# Altium schematic sheet MainSchematic.SchDoc
size A1
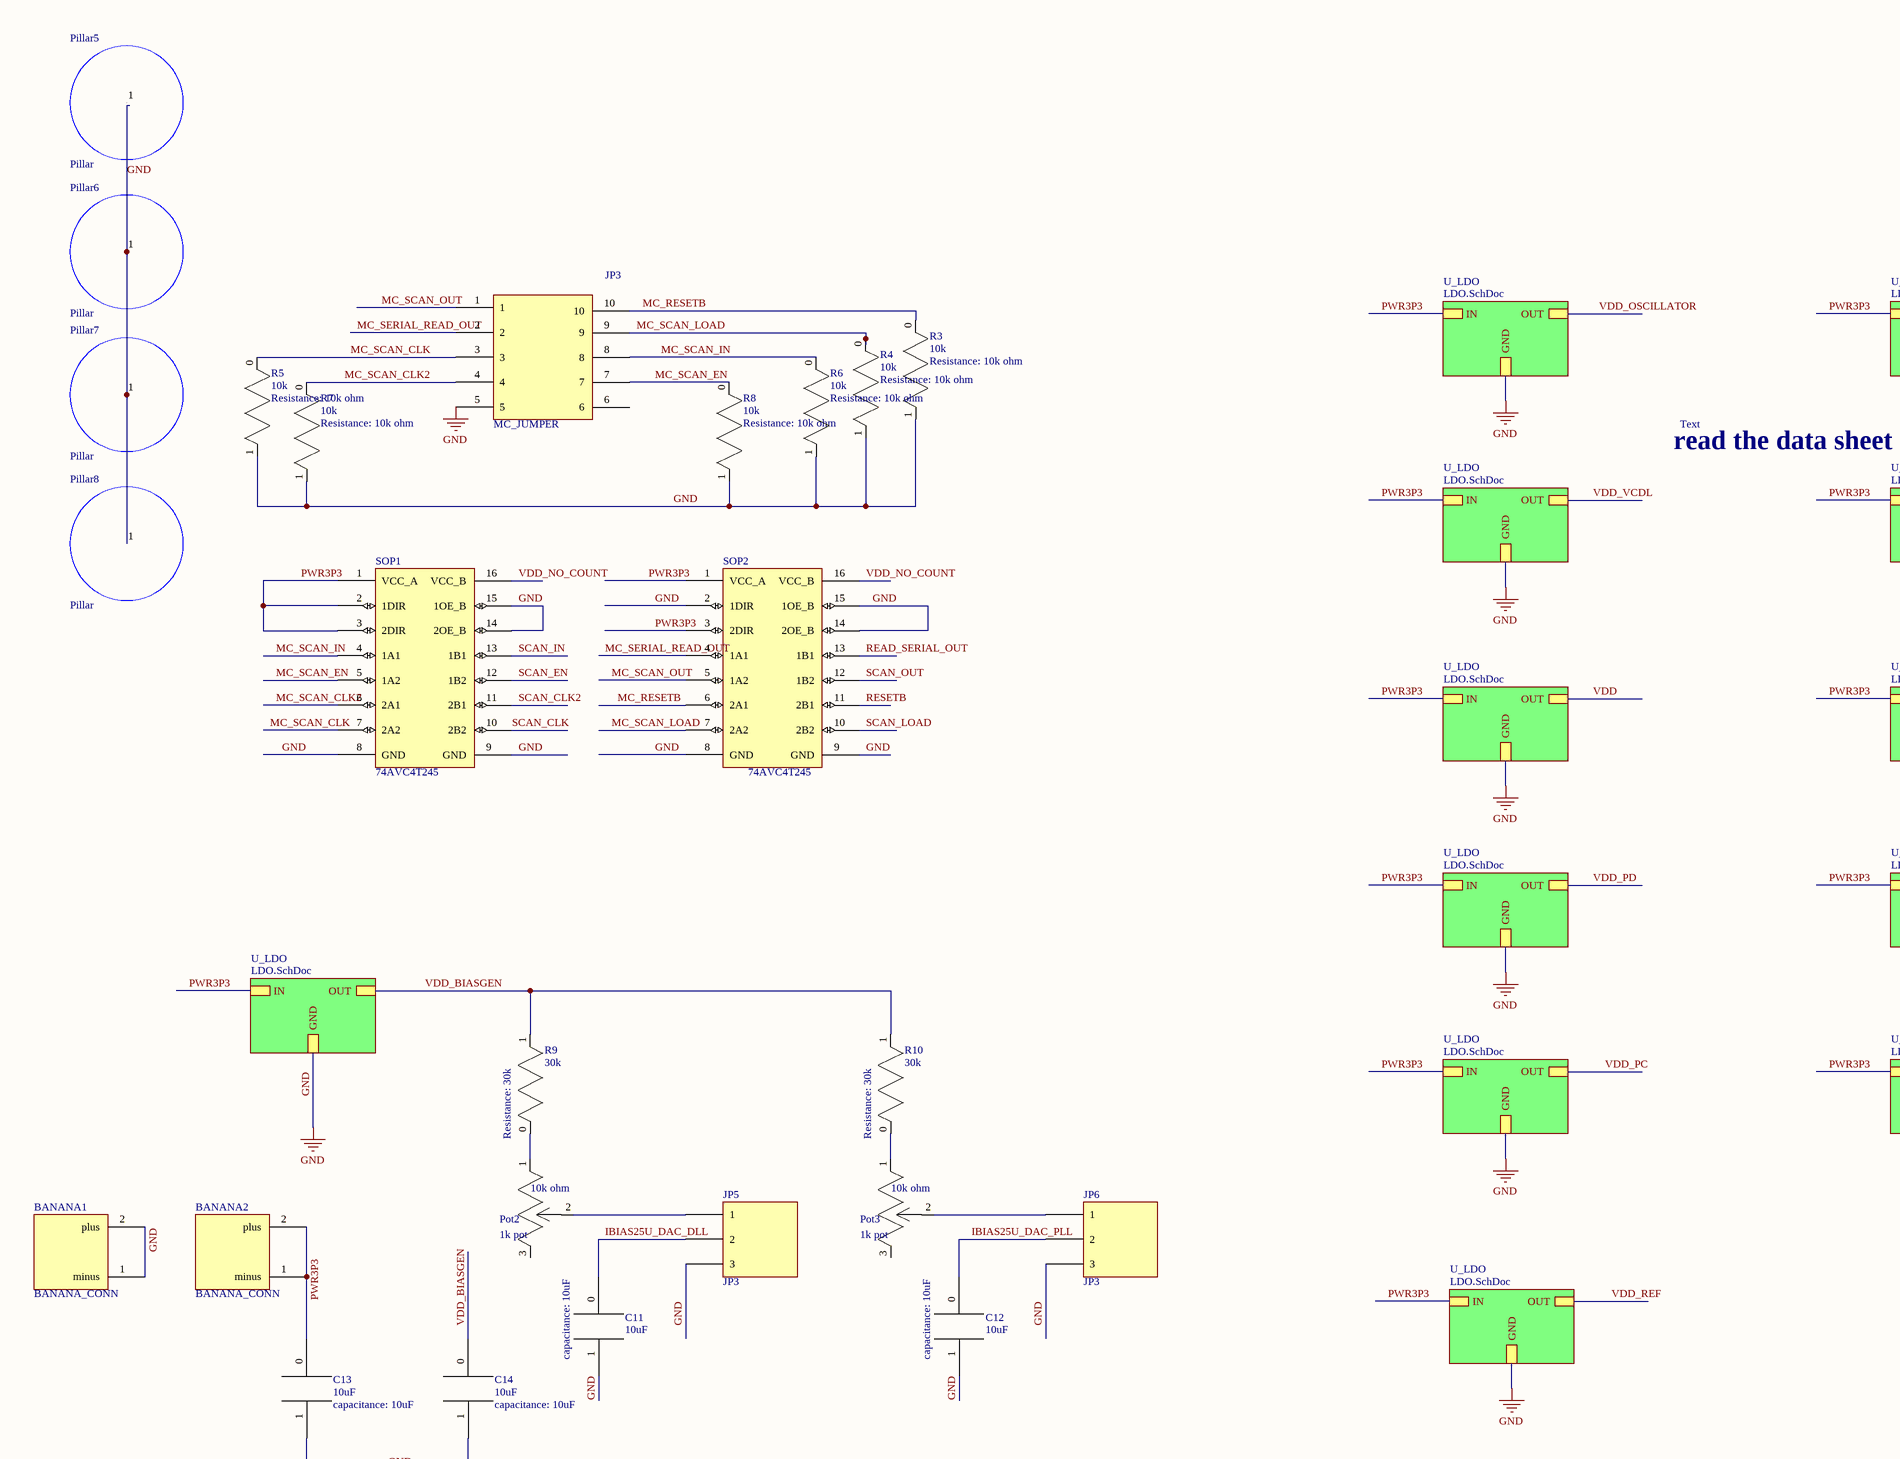
[diagram p0: MainSchematic.SchDoc, top left]
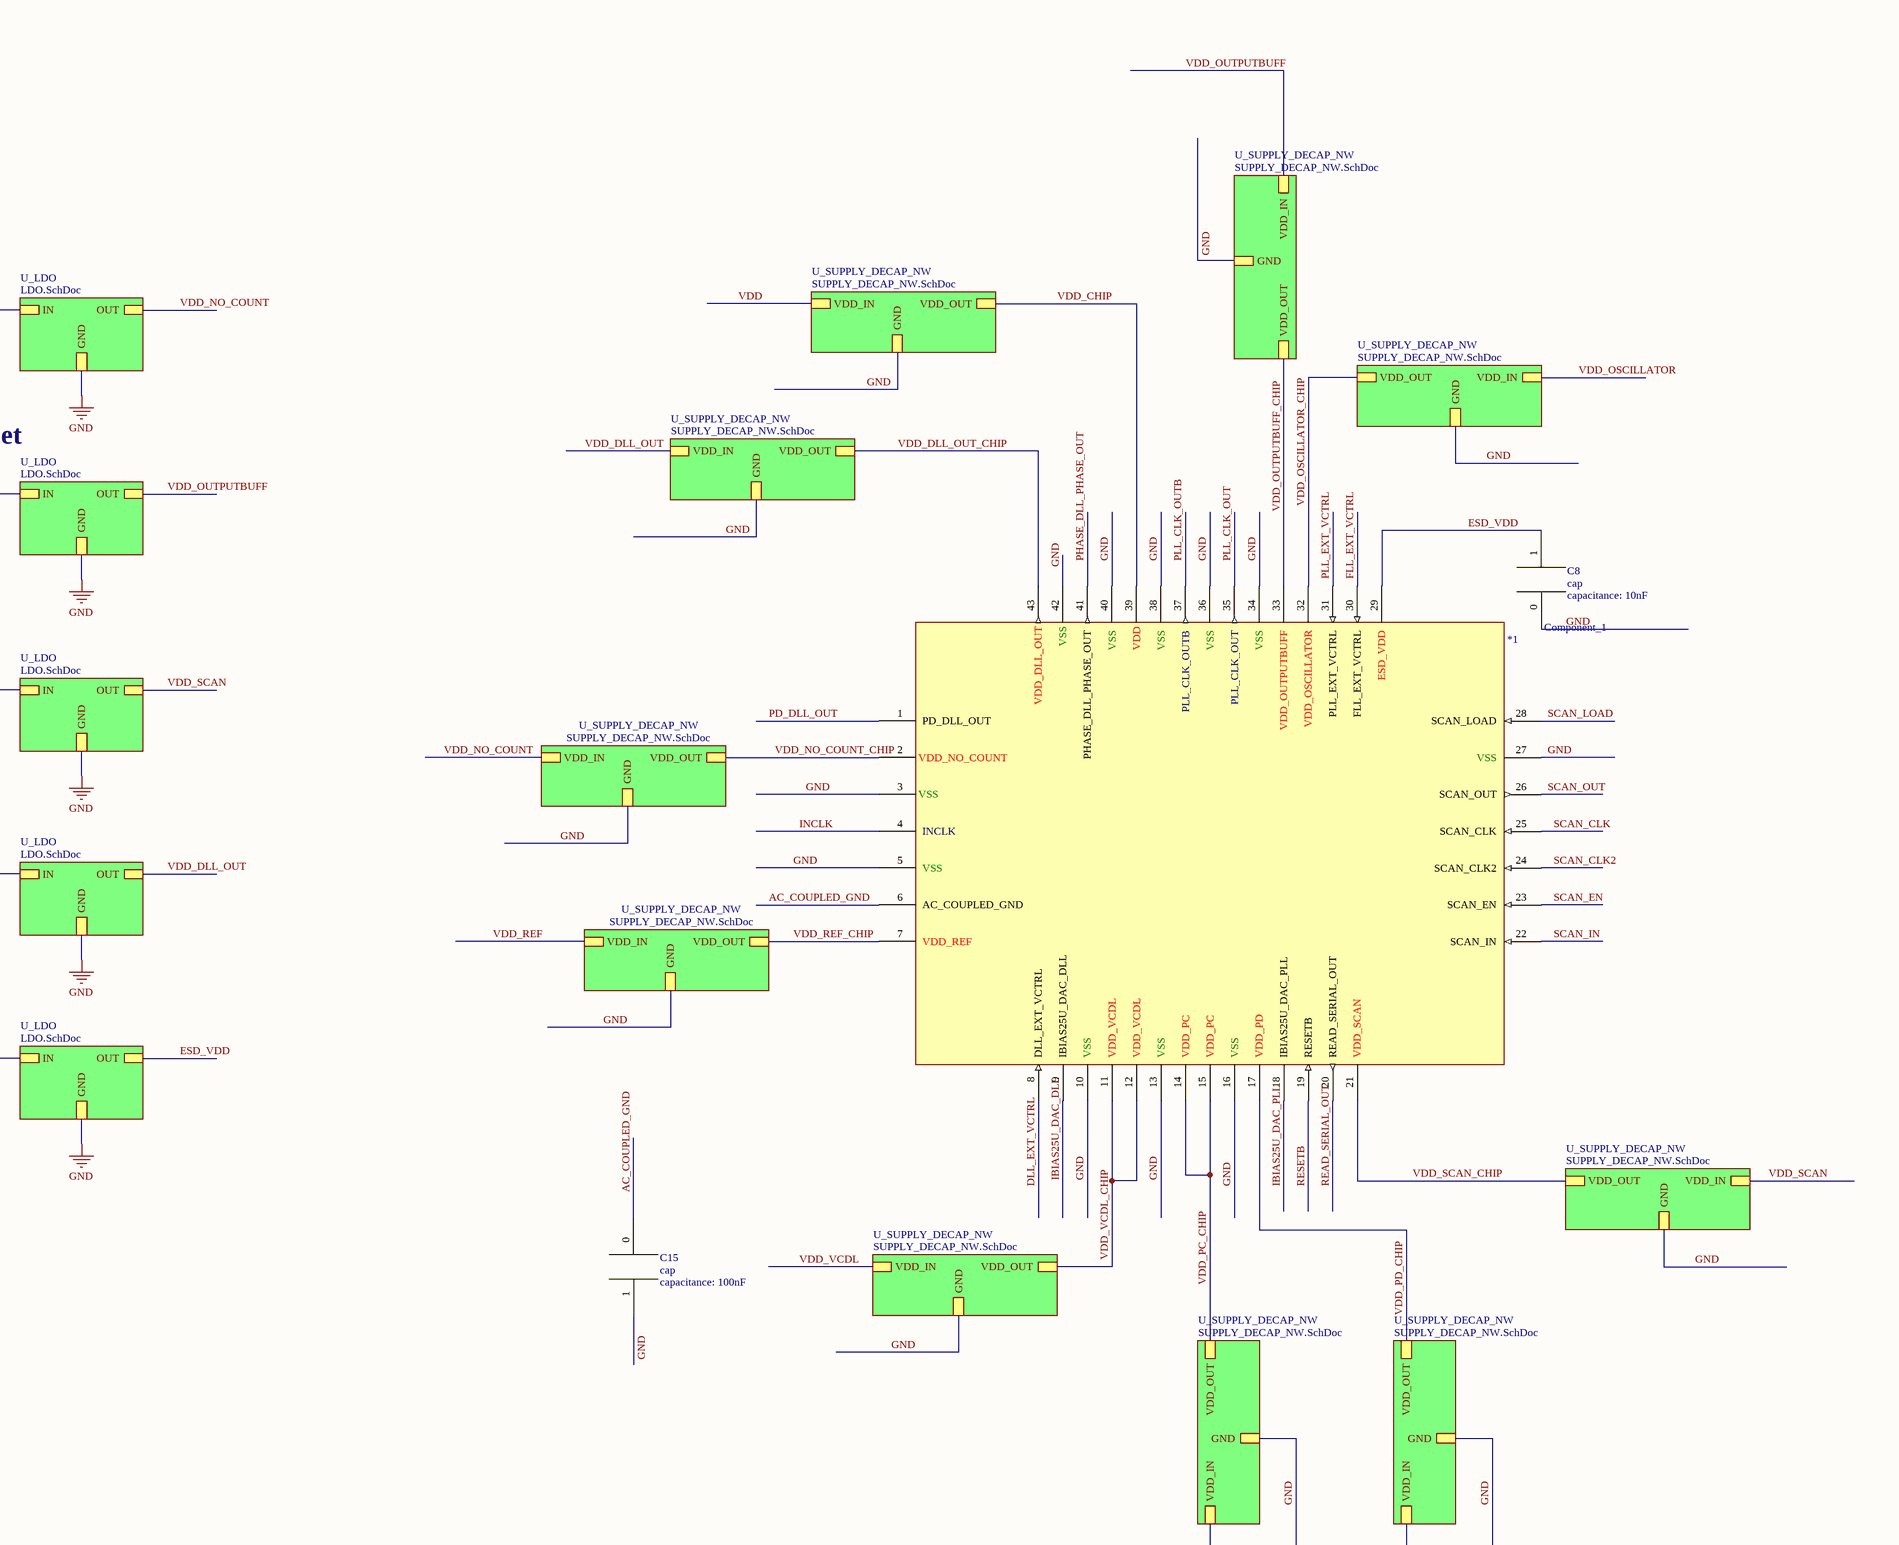
[diagram p1: MainSchematic.SchDoc, top right]
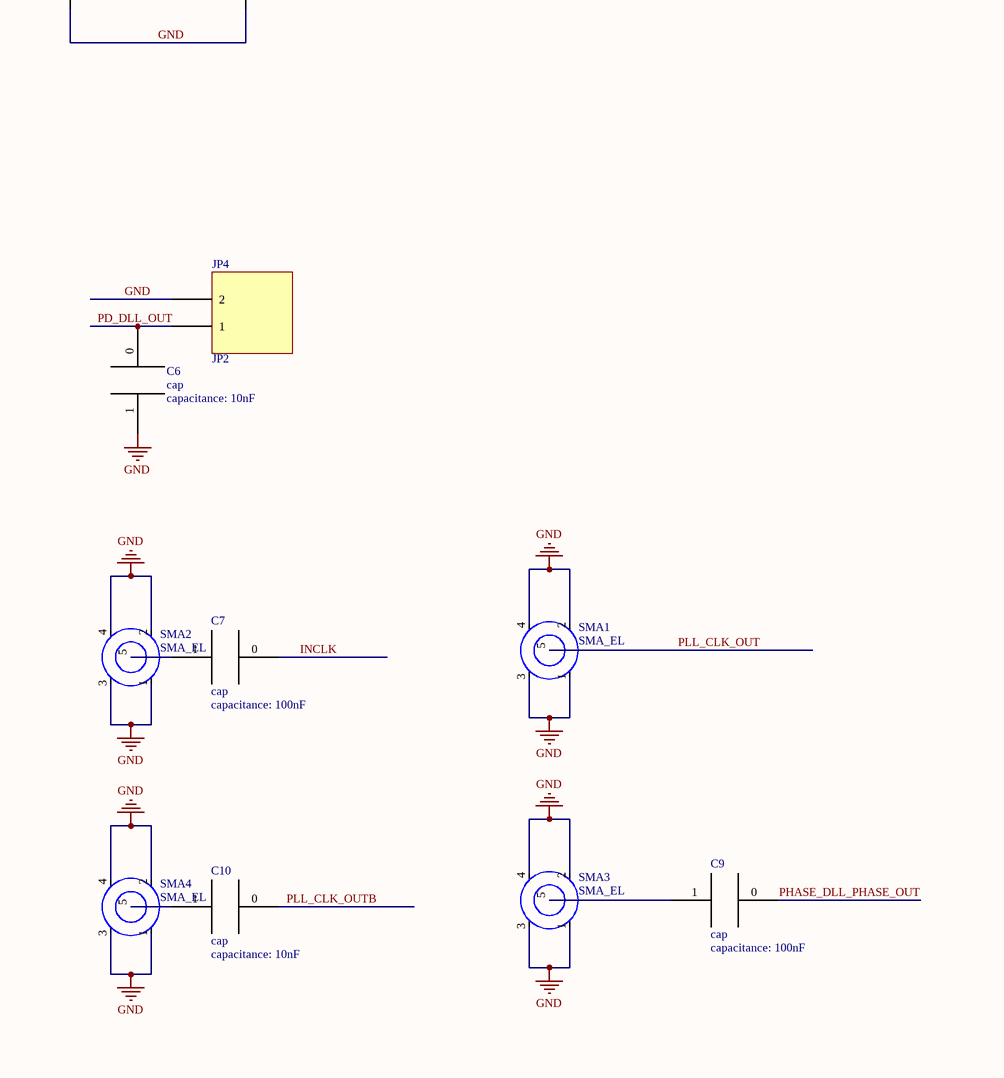
[diagram p2: MainSchematic.SchDoc, bottom left]
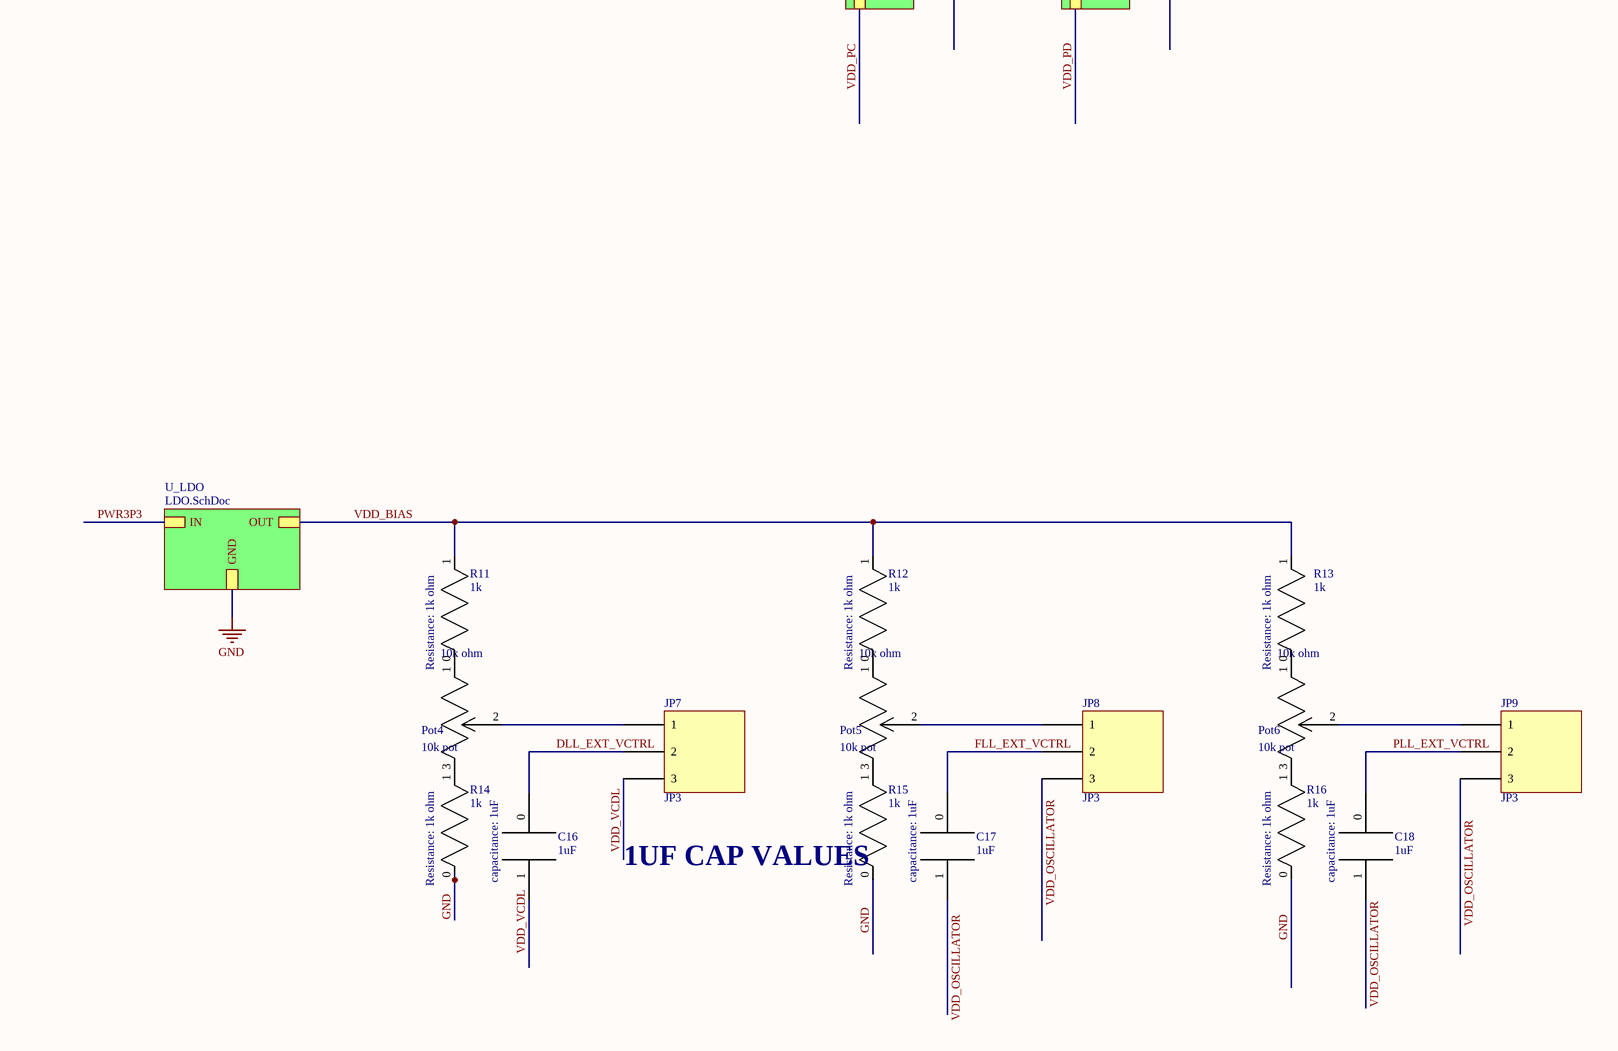
[diagram p3: MainSchematic.SchDoc, bottom right]

## Parts
*1  Component_1  [PCBComponent_1]
BANANA1  BANANA_CONN  [BANANA_CONN]
BANANA2  BANANA_CONN  [BANANA_CONN]
C6  cap  capacitance: 10nF  [Capacitor]
C7  cap  capacitance: 100nF  [Capacitor]
C8  cap  capacitance: 10nF  [Capacitor]
C9  cap  capacitance: 100nF  [Capacitor]
C10  cap  capacitance: 10nF  [Capacitor]
C11  10uF  [Capacitor]
C12  10uF  [Capacitor]
C13  10uF  [Capacitor]
C14  10uF  [Capacitor]
C15  cap  capacitance: 100nF  [Capacitor]
C16  1uF  [Capacitor]
C17  1uF  [Capacitor]
C18  1uF  [Capacitor]
JP3  MC_JUMPER  [JUMPER10]
JP4  JP2  [JUMPER2]
JP5  JP3  [JUMPER3]
JP6  JP3  [JUMPER3]
JP7  JP3  [JUMPER3]
JP8  JP3  [JUMPER3]
JP9  JP3  [JUMPER3]
Pillar5  Pillar  [Pillar_hole]
Pillar6  Pillar  [Pillar_hole]
Pillar7  Pillar  [Pillar_hole]
Pillar8  Pillar  [Pillar_hole]
Pot2  1k pot  Resistance: 10k ohm  [Pot]
Pot3  1k pot  Resistance: 10k ohm  [Pot]
Pot4  10k pot  Resistance: 10k ohm  [Pot]
Pot5  10k pot  Resistance: 10k ohm  [Pot]
Pot6  10k pot  Resistance: 10k ohm  [Pot]
R3  10k  Resistance: 10k ohm  [Resistor]
R4  10k  Resistance: 10k ohm  [Resistor]
R5  10k  Resistance: 10k ohm  [Resistor]
R6  10k  Resistance: 10k ohm  [Resistor]
R7  10k  Resistance: 10k ohm  [Resistor]
R8  10k  Resistance: 10k ohm  [Resistor]
R9  30k  [Resistor]
R10  30k  [Resistor]
R11  1k  Resistance: 1k ohm  [Resistor]
R12  1k  Resistance: 1k ohm  [Resistor]
R13  1k  Resistance: 1k ohm  [Resistor]
R14  1k  Resistance: 1k ohm  [Resistor]
R15  1k  Resistance: 1k ohm  [Resistor]
R16  1k  Resistance: 1k ohm  [Resistor]
SMA1  SMA_EL  [SMA_EL]
SMA2  SMA_EL  [SMA_EL]
SMA3  SMA_EL  [SMA_EL]
SMA4  SMA_EL  [SMA_EL]
SOP1  74AVC4T245  [74AVC4T245]
SOP2  74AVC4T245  [74AVC4T245]

## Sub-sheets
U_LDO = LDO.SchDoc: IN, OUT, GND
U_LDO = LDO.SchDoc: IN, OUT, GND
U_LDO = LDO.SchDoc: IN, OUT, GND
U_LDO = LDO.SchDoc: IN, OUT, GND
U_LDO = LDO.SchDoc: IN, OUT, GND
U_LDO = LDO.SchDoc: IN, OUT, GND
U_LDO = LDO.SchDoc: IN, OUT, GND
U_LDO = LDO.SchDoc: IN, OUT, GND
U_LDO = LDO.SchDoc: IN, OUT, GND
U_LDO = LDO.SchDoc: IN, OUT, GND
U_LDO = LDO.SchDoc: IN, OUT, GND
U_LDO = LDO.SchDoc: IN, OUT, GND
U_LDO = LDO.SchDoc: IN, OUT, GND
U_SUPPLY_DECAP_NW = SUPPLY_DECAP_NW.SchDoc: VDD_IN, GND, VDD_OUT
U_SUPPLY_DECAP_NW = SUPPLY_DECAP_NW.SchDoc: VDD_IN, GND, VDD_OUT
U_SUPPLY_DECAP_NW = SUPPLY_DECAP_NW.SchDoc: VDD_IN, GND, VDD_OUT
U_SUPPLY_DECAP_NW = SUPPLY_DECAP_NW.SchDoc: VDD_IN, GND, VDD_OUT
U_SUPPLY_DECAP_NW = SUPPLY_DECAP_NW.SchDoc: VDD_IN, GND, VDD_OUT
U_SUPPLY_DECAP_NW = SUPPLY_DECAP_NW.SchDoc: VDD_IN, GND, VDD_OUT
U_SUPPLY_DECAP_NW = SUPPLY_DECAP_NW.SchDoc: VDD_IN, GND, VDD_OUT
U_SUPPLY_DECAP_NW = SUPPLY_DECAP_NW.SchDoc: VDD_IN, GND, VDD_OUT
U_SUPPLY_DECAP_NW = SUPPLY_DECAP_NW.SchDoc: VDD_IN, GND, VDD_OUT
U_SUPPLY_DECAP_NW = SUPPLY_DECAP_NW.SchDoc: VDD_IN, GND, VDD_OUT

## Nets
GND: *1.3(VSS) *1.5(VSS) *1.10(VSS) *1.13(VSS) *1.16(VSS) *1.27(VSS) *1.34(VSS) *1.36(VSS) *1.38(VSS) *1.40(VSS) *1.42(VSS) BANANA1.1(minus) BANANA1.2(plus) C6.1 C8.0 C11.1 C12.1 C13.1 C14.1 C15.1 JP3.5 JP4.2 JP5.3 JP6.3 Pillar6.1 Pillar7.1 Pillar8.1 R3.1 R4.1 R5.1 R6.1 R7.1 R8.1 R14.0 R15.0 R16.0 SMA1.1 SMA1.2 SMA1.3 SMA1.4 SMA2.1 SMA2.2 SMA2.3 SMA2.4 SMA3.1 SMA3.2 SMA3.3 SMA3.4 SMA4.1 SMA4.2 SMA4.3 SMA4.4 SOP1.8(GND) SOP1.9(GND) SOP1.14(2OE_B) SOP1.15(1OE_B) SOP2.2(1DIR) SOP2.8(GND) SOP2.9(GND) SOP2.14(2OE_B) SOP2.15(1OE_B) ; sheet U_LDO/GND, sheet U_LDO/GND, sheet U_LDO/GND, sheet U_LDO/GND, sheet U_LDO/GND, sheet U_LDO/GND, sheet U_LDO/GND, sheet U_LDO/GND, sheet U_LDO/GND, sheet U_LDO/GND, sheet U_LDO/GND, sheet U_LDO/GND, sheet U_LDO/GND, sheet U_SUPPLY_DECAP_NW/GND, sheet U_SUPPLY_DECAP_NW/GND, sheet U_SUPPLY_DECAP_NW/GND, sheet U_SUPPLY_DECAP_NW/GND, sheet U_SUPPLY_DECAP_NW/GND, sheet U_SUPPLY_DECAP_NW/GND, sheet U_SUPPLY_DECAP_NW/GND, sheet U_SUPPLY_DECAP_NW/GND, sheet U_SUPPLY_DECAP_NW/GND, sheet U_SUPPLY_DECAP_NW/GND
AC_COUPLED_GND: *1.6(AC_COUPLED_GND) C15.0
DLL_EXT_VCTRL: *1.8(DLL_EXT_VCTRL) C16.0 JP7.2
ESD_VDD: *1.29(ESD_VDD) C8.1 ; sheet U_LDO/OUT
FLL_EXT_VCTRL: *1.30(FLL_EXT_VCTRL) C17.0 JP8.2
IBIAS25U_DAC_DLL: *1.9(IBIAS25U_DAC_DLL) C11.0 JP5.2
IBIAS25U_DAC_PLL: *1.18(IBIAS25U_DAC_PLL) C12.0 JP6.2
INCLK: *1.4(INCLK) C7.0
MC_RESETB: JP3.10 R3.0 SOP2.6(2A1)
MC_SCAN_CLK: JP3.3 R5.0 SOP1.7(2A2)
MC_SCAN_CLK2: JP3.4 R7.0 SOP1.6(2A1)
MC_SCAN_EN: JP3.7 R8.0 SOP1.5(1A2)
MC_SCAN_IN: JP3.8 R6.0 SOP1.4(1A1)
MC_SCAN_LOAD: JP3.9 R4.0 SOP2.7(2A2)
MC_SCAN_OUT: JP3.1 SOP2.5(1A2)
MC_SERIAL_READ_OUT: JP3.2 SOP2.4(1A1)
PD_DLL_OUT: *1.1(PD_DLL_OUT) C6.0 JP4.1
PHASE_DLL_PHASE_OUT: *1.41(PHASE_DLL_PHASE_OUT) C9.0
PLL_CLK_OUT: *1.35(PLL_CLK_OUT) SMA1.5
PLL_CLK_OUTB: *1.37(PLL_CLK_OUTB) C10.0
PLL_EXT_VCTRL: *1.31(PLL_EXT_VCTRL) C18.0 JP9.2
PWR3P3: BANANA2.1(minus) BANANA2.2(plus) C13.0 SOP1.1(VCC_A) SOP1.2(1DIR) SOP1.3(2DIR) SOP2.1(VCC_A) SOP2.3(2DIR) ; sheet U_LDO/IN, sheet U_LDO/IN, sheet U_LDO/IN, sheet U_LDO/IN, sheet U_LDO/IN, sheet U_LDO/IN, sheet U_LDO/IN, sheet U_LDO/IN, sheet U_LDO/IN, sheet U_LDO/IN, sheet U_LDO/IN, sheet U_LDO/IN, sheet U_LDO/IN
READ_SERIAL_OUT: *1.20(READ_SERIAL_OUT) SOP2.13(1B1)
RESETB: *1.19(RESETB) SOP2.11(2B1)
SCAN_CLK: *1.25(SCAN_CLK) SOP1.10(2B2)
SCAN_CLK2: *1.24(SCAN_CLK2) SOP1.11(2B1)
SCAN_EN: *1.23(SCAN_EN) SOP1.12(1B2)
SCAN_IN: *1.22(SCAN_IN) SOP1.13(1B1)
SCAN_LOAD: *1.28(SCAN_LOAD) SOP2.10(2B2)
SCAN_OUT: *1.26(SCAN_OUT) SOP2.12(1B2)
VDD: sheet U_LDO/OUT, sheet U_SUPPLY_DECAP_NW/VDD_IN
VDD_BIAS: R11.1 R12.1 R13.1 ; sheet U_LDO/OUT
VDD_BIASGEN: C14.0 R9.1 R10.1 ; sheet U_LDO/OUT
VDD_CHIP: *1.39(VDD) ; sheet U_SUPPLY_DECAP_NW/VDD_OUT
VDD_DLL_OUT: sheet U_LDO/OUT, sheet U_SUPPLY_DECAP_NW/VDD_IN
VDD_DLL_OUT_CHIP: *1.43(VDD_DLL_OUT) ; sheet U_SUPPLY_DECAP_NW/VDD_OUT
VDD_NO_COUNT: SOP1.16(VCC_B) SOP2.16(VCC_B) ; sheet U_LDO/OUT, sheet U_SUPPLY_DECAP_NW/VDD_IN
VDD_NO_COUNT_CHIP: *1.2(VDD_NO_COUNT) ; sheet U_SUPPLY_DECAP_NW/VDD_OUT
VDD_OSCILLATOR: C17.1 C18.1 JP8.3 JP9.3 ; sheet U_LDO/OUT, sheet U_SUPPLY_DECAP_NW/VDD_IN
VDD_OSCILLATOR_CHIP: *1.32(VDD_OSCILLATOR) ; sheet U_SUPPLY_DECAP_NW/VDD_OUT
VDD_OUTPUTBUFF: sheet U_LDO/OUT, sheet U_SUPPLY_DECAP_NW/VDD_IN
VDD_OUTPUTBUFF_CHIP: *1.33(VDD_OUTPUTBUFF) ; sheet U_SUPPLY_DECAP_NW/VDD_OUT
VDD_PC: sheet U_LDO/OUT, sheet U_SUPPLY_DECAP_NW/VDD_IN
VDD_PC_CHIP: *1.14(VDD_PC) *1.15(VDD_PC) ; sheet U_SUPPLY_DECAP_NW/VDD_OUT
VDD_PD: sheet U_LDO/OUT, sheet U_SUPPLY_DECAP_NW/VDD_IN
VDD_PD_CHIP: *1.17(VDD_PD) ; sheet U_SUPPLY_DECAP_NW/VDD_OUT
VDD_REF: sheet U_LDO/OUT, sheet U_SUPPLY_DECAP_NW/VDD_IN
VDD_REF_CHIP: *1.7(VDD_REF) ; sheet U_SUPPLY_DECAP_NW/VDD_OUT
VDD_SCAN: sheet U_LDO/OUT, sheet U_SUPPLY_DECAP_NW/VDD_IN
VDD_SCAN_CHIP: *1.21(VDD_SCAN) ; sheet U_SUPPLY_DECAP_NW/VDD_OUT
VDD_VCDL: C16.1 JP7.3 ; sheet U_LDO/OUT, sheet U_SUPPLY_DECAP_NW/VDD_IN
VDD_VCDL_CHIP: *1.11(VDD_VCDL) *1.12(VDD_VCDL) ; sheet U_SUPPLY_DECAP_NW/VDD_OUT
NetC7_1: C7.1 SMA2.5
NetC9_1: C9.1 SMA3.5
NetC10_1: C10.1 SMA4.5
NetJP5_1: JP5.1 Pot2.2
NetJP6_1: JP6.1 Pot3.2
NetJP7_1: JP7.1 Pot4.2
NetJP8_1: JP8.1 Pot5.2
NetJP9_1: JP9.1 Pot6.2
NetPot2_1: Pot2.1 R9.0
NetPot3_1: Pot3.1 R10.0
NetPot4_1: Pot4.1 R11.0
NetPot4_3: Pot4.3 R14.1
NetPot5_1: Pot5.1 R12.0
NetPot5_3: Pot5.3 R15.1
NetPot6_1: Pot6.1 R13.0
NetPot6_3: Pot6.3 R16.1

Not connected (* = marked no-connect by the designer): JP3 6; Pillar5 1; Pot2 3; Pot3 3

## Notes on the sheet
- read the data sheet
- Text
- 1UF CAP VALUES

## Library data of the parts
BANANA1 BANANA2 = BANANA_CONN: Rule: UNIONINDEX{}0[]RULEKIND{}SolderMaskExpansion[]NETSCOPE{}AnyNet[]LAYERKIND{}SameLayer[]NAME{}Schematic Solder Mask Expansion[]EXPANSION{}5mil[]UNIT{}Imperial[]PcbType{}ProtelPcb
C6-C18 = cap: 0603cap; Rule: UNIONINDEX{}0[]RULEKIND{}SolderMaskExpansion[]NETSCOPE{}AnyNet[]LAYERKIND{}SameLayer[]NAME{}Schematic Solder Mask Expansion[]EXPANSION{}5mil[]UNIT{}Imperial[]PcbType{}ProtelPcb
  C11-C14: capacitance: 10uF
  C16-C18: capacitance: 1uF
JP3 = Jumper_10: Jumper_10p; Rule: UNIONINDEX{}0[]RULEKIND{}SolderMaskExpansion[]NETSCOPE{}AnyNet[]LAYERKIND{}SameLayer[]NAME{}Schematic Solder Mask Expansion[]EXPANSION{}5mil[]UNIT{}Imperial[]PcbType{}ProtelPcb
JP4 = Jumper_2: Rule: UNIONINDEX{}0[]RULEKIND{}SolderMaskExpansion[]NETSCOPE{}AnyNet[]LAYERKIND{}SameLayer[]NAME{}Schematic Solder Mask Expansion[]EXPANSION{}5mil[]UNIT{}Imperial[]PcbType{}ProtelPcb
JP5-JP9 = Jumper_3: Jumper_3p; Rule: UNIONINDEX{}0[]RULEKIND{}SolderMaskExpansion[]NETSCOPE{}AnyNet[]LAYERKIND{}SameLayer[]NAME{}Schematic Solder Mask Expansion[]EXPANSION{}5mil[]UNIT{}Imperial[]PcbType{}ProtelPcb
Pillar5-Pillar8 = Pillar_hole
Pot2-Pot6 = Pot: Variable Resistor; Rule: UNIONINDEX{}0[]RULEKIND{}SolderMaskExpansion[]NETSCOPE{}AnyNet[]LAYERKIND{}SameLayer[]NAME{}Schematic Solder Mask Expansion[]EXPANSION{}5mil[]UNIT{}Imperial[]PcbType{}ProtelPcb
R3-R16 = res: 0603Res; Rule: UNIONINDEX{}0[]RULEKIND{}SolderMaskExpansion[]NETSCOPE{}AnyNet[]LAYERKIND{}SameLayer[]NAME{}Schematic Solder Mask Expansion[]EXPANSION{}5mil[]UNIT{}Imperial[]PcbType{}ProtelPcb
  R9 R10: Resistance: 30k
SMA1-SMA4 = SMA_EL: Rule: UNIONINDEX{}0[]RULEKIND{}SolderMaskExpansion[]NETSCOPE{}AnyNet[]LAYERKIND{}SameLayer[]NAME{}Schematic Solder Mask Expansion[]EXPANSION{}5mil[]UNIT{}Imperial[]PcbType{}ProtelPcb
SOP1 SOP2 = 74AVC4T245: 74AVC4T245 Voltage Shifter; Rule: UNIONINDEX{}0[]RULEKIND{}SolderMaskExpansion[]NETSCOPE{}AnyNet[]LAYERKIND{}SameLayer[]NAME{}Schematic Solder Mask Expansion[]EXPANSION{}5mil[]UNIT{}Imperial[]PcbType{}ProtelPcb